# Altium schematic sheet B106AA Block Diagram.SchDoc: Weather Station Block Diagram
size A3; SheetNumber: 1; SheetTotal: 37
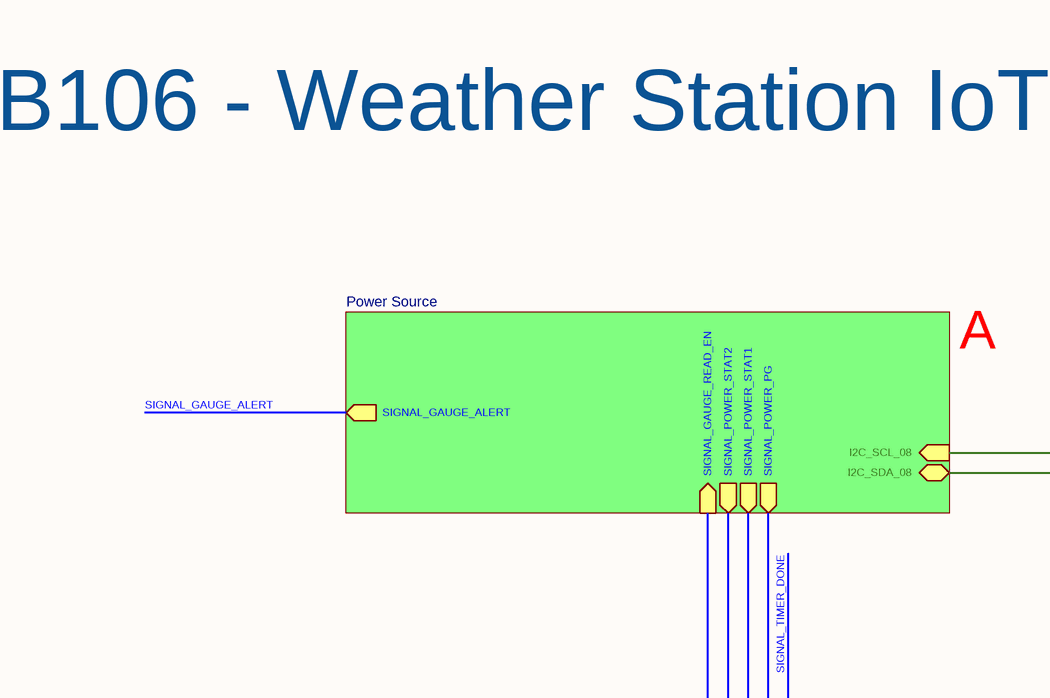
[diagram p0: B106AA Block Diagram.SchDoc, top left]
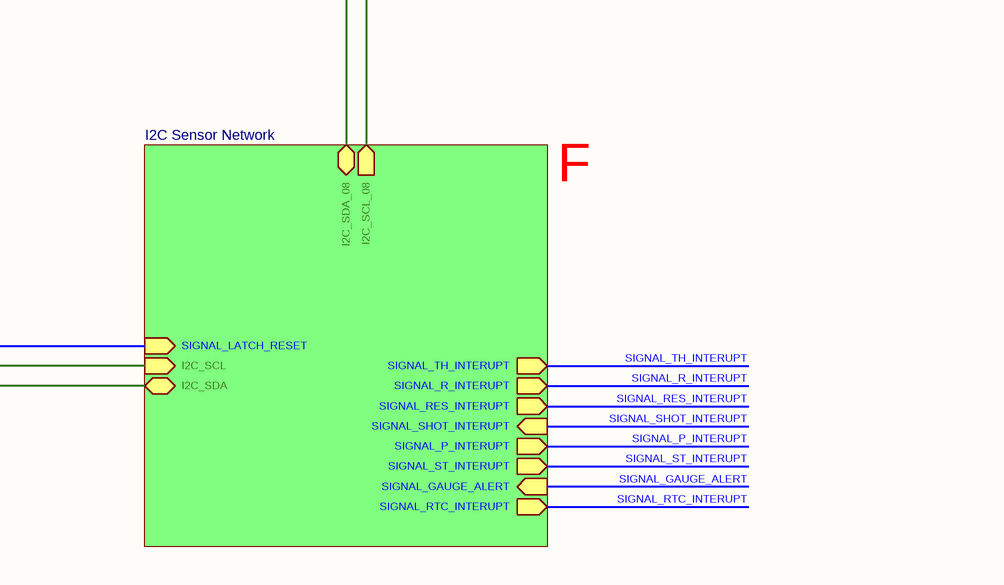
[diagram p1: B106AA Block Diagram.SchDoc, top right]
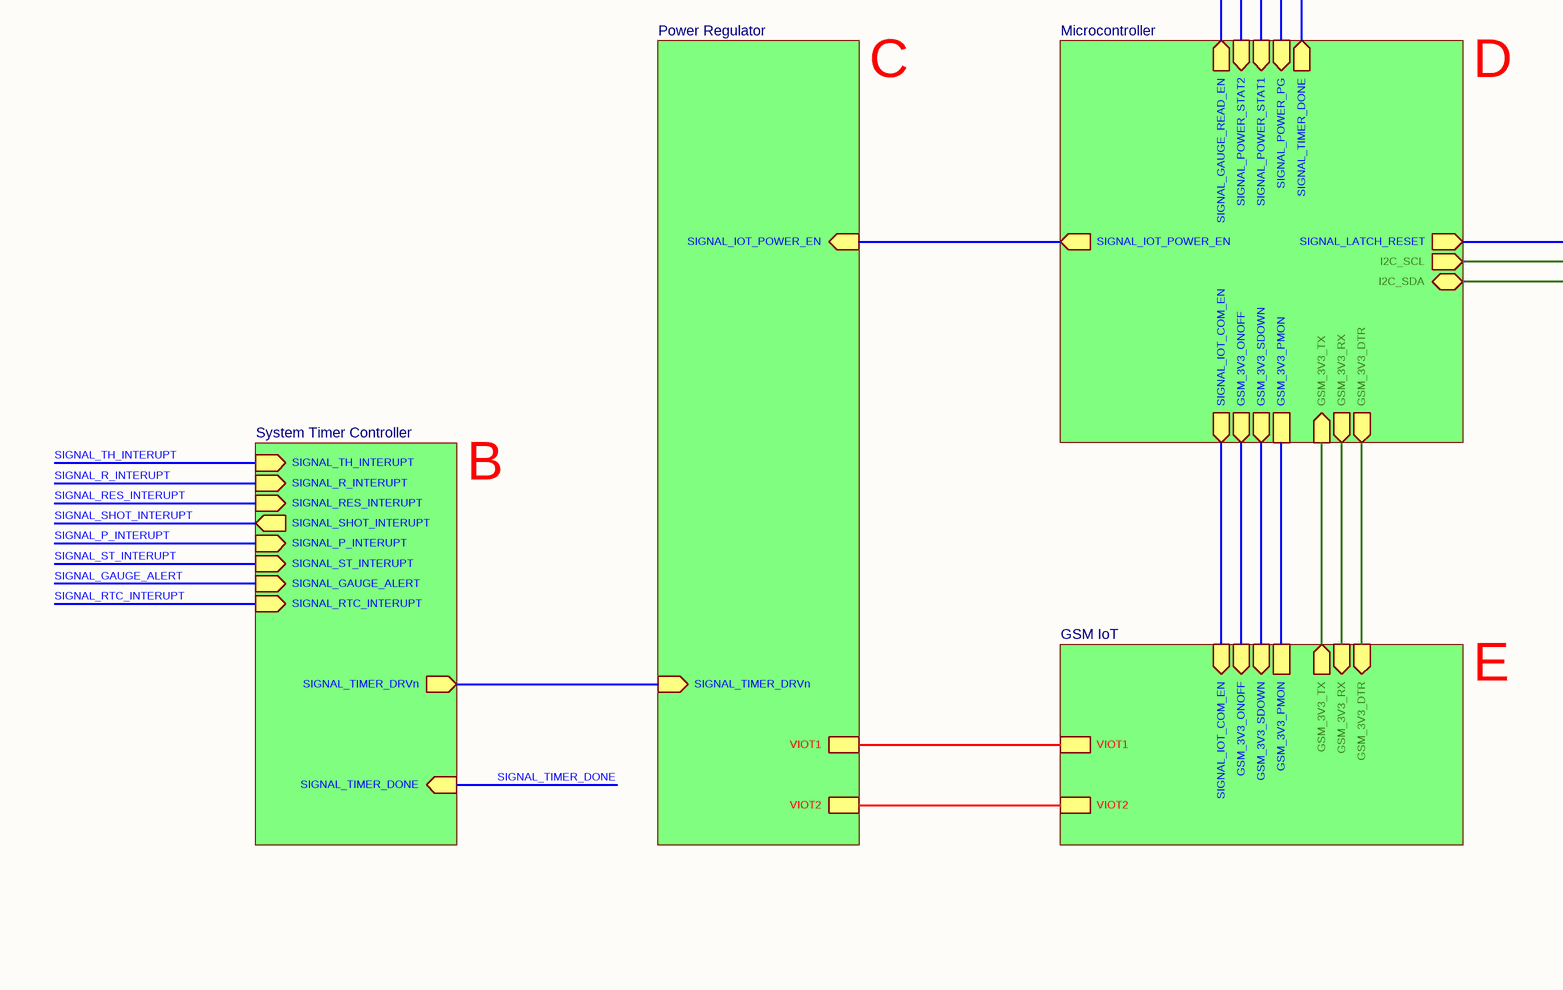
[diagram p2: B106AA Block Diagram.SchDoc, bottom left]
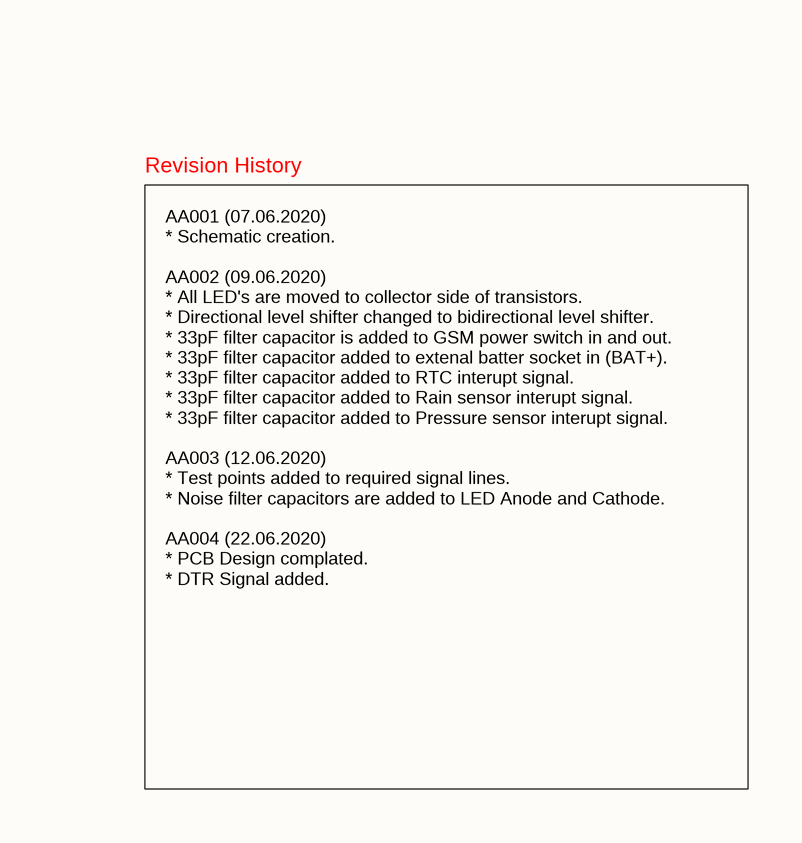
[diagram p3: B106AA Block Diagram.SchDoc, bottom right]

## Sub-sheets
GSM IoT = GSM IoT.SchDoc: GSM_3V3_PMON, SIGNAL_IOT_COM_EN (in), GSM_3V3_ONOFF (in), GSM_3V3_SDOWN (in), VIOT1, VIOT2, GSM_3V3_TX (out), GSM_3V3_RX (in), GSM_3V3_DTR (in)
I2C Sensor Network = I2C Sensor Network.SchDoc: SIGNAL_ST_INTERUPT (out), SIGNAL_TH_INTERUPT (out), SIGNAL_P_INTERUPT (out), SIGNAL_RES_INTERUPT (out), SIGNAL_R_INTERUPT (out), SIGNAL_GAUGE_ALERT (in), SIGNAL_RTC_INTERUPT (out), SIGNAL_LATCH_RESET (in), SIGNAL_SHOT_INTERUPT (in), I2C_SDA (bidir), I2C_SCL (in), I2C_SDA_08 (bidir), I2C_SCL_08 (out)
Microcontroller = Microcontroller.SchDoc: SIGNAL_IOT_POWER_EN (out), GSM_3V3_PMON, GSM_3V3_ONOFF (out), SIGNAL_IOT_COM_EN (out), GSM_3V3_SDOWN (out), SIGNAL_POWER_STAT2 (in), SIGNAL_POWER_STAT1 (in), SIGNAL_POWER_PG (in), SIGNAL_LATCH_RESET (out), SIGNAL_TIMER_DONE (out), SIGNAL_GAUGE_READ_EN (out), GSM_3V3_TX (in), GSM_3V3_RX (out), I2C_SCL (out), I2C_SDA (bidir), GSM_3V3_DTR (out)
Power Regulator = Power Regulator.SchDoc: VIOT2, SIGNAL_TIMER_DRVn (in), SIGNAL_IOT_POWER_EN (in), VIOT1
Power Source = Power Source.SchDoc: SIGNAL_GAUGE_ALERT (out), SIGNAL_GAUGE_READ_EN (in), SIGNAL_POWER_STAT2 (out), SIGNAL_POWER_STAT1 (out), SIGNAL_POWER_PG (out), I2C_SCL_08 (in), I2C_SDA_08 (bidir)
System Timer Controller = System Timer.SchDoc: SIGNAL_GAUGE_ALERT (in), SIGNAL_ST_INTERUPT (in), SIGNAL_TIMER_DONE (in), SIGNAL_RES_INTERUPT (in), SIGNAL_TH_INTERUPT (in), SIGNAL_R_INTERUPT (in), SIGNAL_P_INTERUPT (in), SIGNAL_TIMER_DRVn (out), SIGNAL_RTC_INTERUPT (in), SIGNAL_SHOT_INTERUPT (out)

## Nets
SIGNAL_GAUGE_ALERT: sheet System Timer Controller/SIGNAL_GAUGE_ALERT, sheet Power Source/SIGNAL_GAUGE_ALERT, sheet I2C Sensor Network/SIGNAL_GAUGE_ALERT
SIGNAL_P_INTERUPT: sheet System Timer Controller/SIGNAL_P_INTERUPT, sheet I2C Sensor Network/SIGNAL_P_INTERUPT
SIGNAL_R_INTERUPT: sheet System Timer Controller/SIGNAL_R_INTERUPT, sheet I2C Sensor Network/SIGNAL_R_INTERUPT
SIGNAL_RES_INTERUPT: sheet System Timer Controller/SIGNAL_RES_INTERUPT, sheet I2C Sensor Network/SIGNAL_RES_INTERUPT
SIGNAL_RTC_INTERUPT: sheet System Timer Controller/SIGNAL_RTC_INTERUPT, sheet I2C Sensor Network/SIGNAL_RTC_INTERUPT
SIGNAL_SHOT_INTERUPT: sheet System Timer Controller/SIGNAL_SHOT_INTERUPT, sheet I2C Sensor Network/SIGNAL_SHOT_INTERUPT
SIGNAL_ST_INTERUPT: sheet System Timer Controller/SIGNAL_ST_INTERUPT, sheet I2C Sensor Network/SIGNAL_ST_INTERUPT
SIGNAL_TH_INTERUPT: sheet System Timer Controller/SIGNAL_TH_INTERUPT, sheet I2C Sensor Network/SIGNAL_TH_INTERUPT
SIGNAL_TIMER_DONE: sheet Microcontroller/SIGNAL_TIMER_DONE, sheet System Timer Controller/SIGNAL_TIMER_DONE
(unnamed): sheet Microcontroller/SIGNAL_IOT_POWER_EN, sheet Power Regulator/SIGNAL_IOT_POWER_EN
(unnamed): sheet Microcontroller/GSM_3V3_PMON, sheet GSM IoT/GSM_3V3_PMON
(unnamed): sheet Microcontroller/GSM_3V3_ONOFF, sheet GSM IoT/GSM_3V3_ONOFF
(unnamed): sheet Microcontroller/SIGNAL_IOT_COM_EN, sheet GSM IoT/SIGNAL_IOT_COM_EN
(unnamed): sheet Microcontroller/GSM_3V3_SDOWN, sheet GSM IoT/GSM_3V3_SDOWN
(unnamed): sheet Microcontroller/SIGNAL_POWER_STAT2, sheet Power Source/SIGNAL_POWER_STAT2
(unnamed): sheet Microcontroller/SIGNAL_POWER_STAT1, sheet Power Source/SIGNAL_POWER_STAT1
(unnamed): sheet Microcontroller/SIGNAL_POWER_PG, sheet Power Source/SIGNAL_POWER_PG
(unnamed): sheet Microcontroller/SIGNAL_LATCH_RESET, sheet I2C Sensor Network/SIGNAL_LATCH_RESET
(unnamed): sheet Microcontroller/SIGNAL_GAUGE_READ_EN, sheet Power Source/SIGNAL_GAUGE_READ_EN
(unnamed): sheet Microcontroller/GSM_3V3_TX, sheet GSM IoT/GSM_3V3_TX
(unnamed): sheet Microcontroller/GSM_3V3_RX, sheet GSM IoT/GSM_3V3_RX
(unnamed): sheet Microcontroller/I2C_SCL, sheet I2C Sensor Network/I2C_SCL
(unnamed): sheet Microcontroller/I2C_SDA, sheet I2C Sensor Network/I2C_SDA
(unnamed): sheet Microcontroller/GSM_3V3_DTR, sheet GSM IoT/GSM_3V3_DTR
(unnamed): sheet GSM IoT/VIOT1, sheet Power Regulator/VIOT1
(unnamed): sheet GSM IoT/VIOT2, sheet Power Regulator/VIOT2
(unnamed): sheet System Timer Controller/SIGNAL_TIMER_DRVn, sheet Power Regulator/SIGNAL_TIMER_DRVn
(unnamed): sheet Power Source/I2C_SCL_08, sheet I2C Sensor Network/I2C_SCL_08
(unnamed): sheet Power Source/I2C_SDA_08, sheet I2C Sensor Network/I2C_SDA_08

## Notes on the sheet
- B106 - Weather Station IoT Module
- A
- C
- D
- F
- B
- E
- Revision History
- AA001 (07.06.2020)
  * Schematic creation.
  AA002 (09.06.2020)
  * All LED's are moved to collector side of transistors.
  * Directional level shifter changed to bidirectional level shifter.
  * 33pF filter capacitor is added to GSM power switch in and out.
  * 33pF filter capacitor added to extenal batter socket in (BAT+).
  * 33pF filter capacitor added to RTC interupt signal.
  * 33pF filter capacitor added to Rain sensor interupt signal.
  * 33pF filter capacitor added to Pressure sensor interupt signal.
  AA003 (12.06.2020)
  * Test points added to required signal lines.
  * Noise filter capacitors are added to LED Anode and Cathode.
  AA004 (22.06.2020)
  * PCB Design complated.
  * DTR Signal added.
- Title
- Size:
- Date:
- A3
- Number:
- Time:
- Revision:
- Sheet
- of
- File: